# Altium schematic sheet 背景抑制经济款电子元器件示意图 - 20251224.SchDoc
size A2
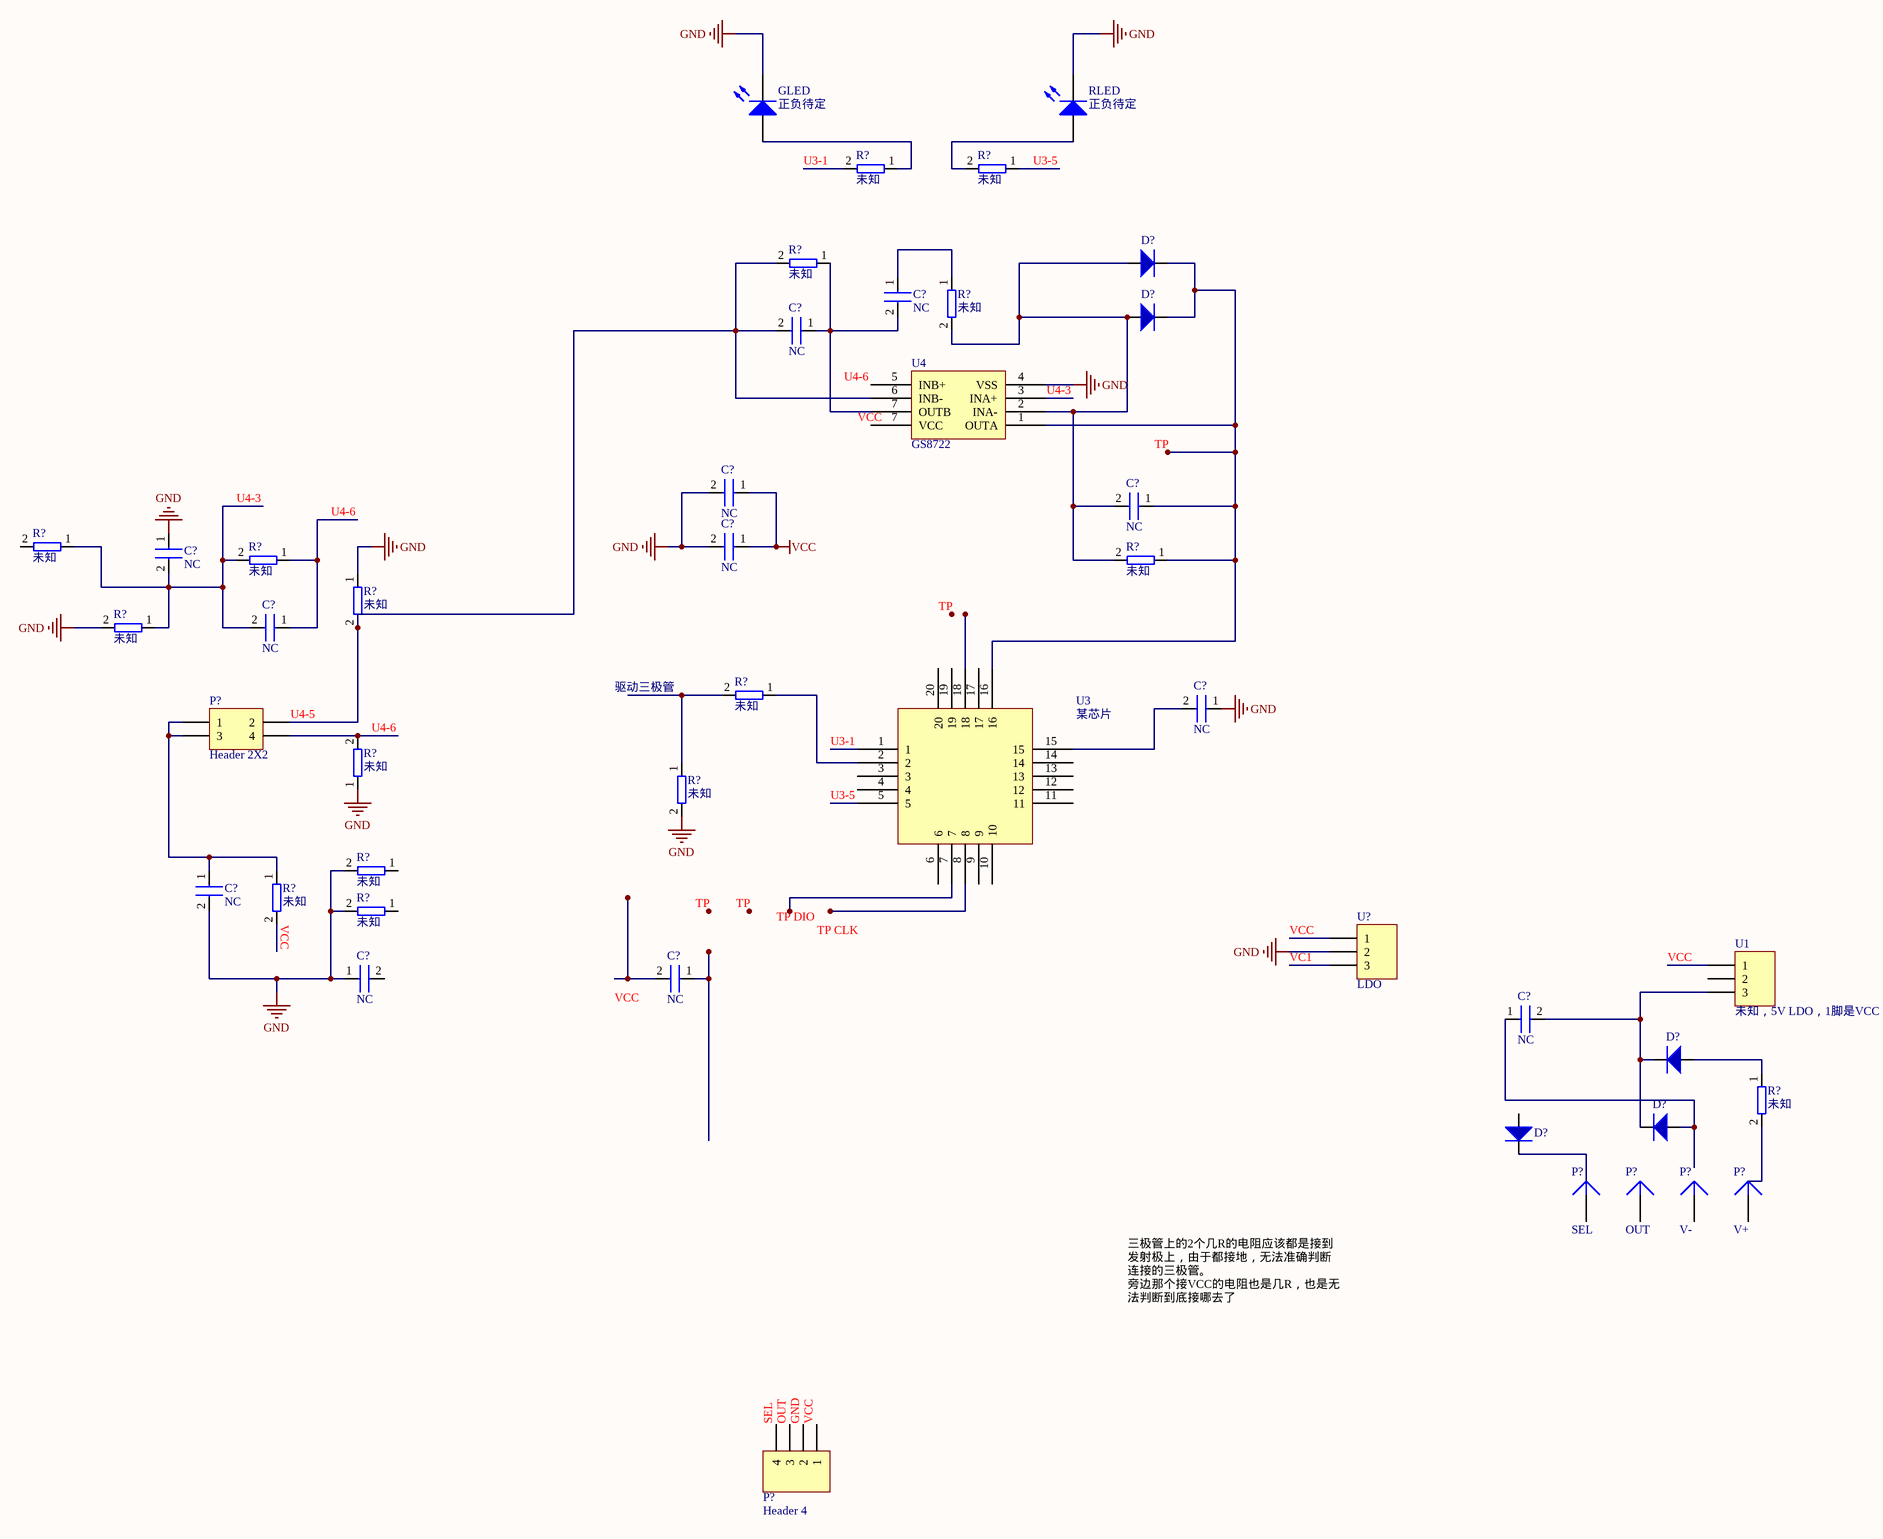
[diagram p0: 背景抑制经济款电子元器件示意图 - 20251224.SchDoc]

## Parts
(Parts that share a designator on the sheet are numbered #1, #2 ... from top to bottom, then left to right.)
C?#1  NC
C?#2  NC
C?#3  NC
C?#4  NC
C?#5  NC
C?#6  NC
C?#7  NC
C?#8  NC
C?#9  NC
C?#10  NC
C?#11  NC
C?#12  NC
D?#1  (no value)
D?#2  (no value)
D?#3  (no value)
D?#4  (no value)
D?#5  (no value)
GLED  正负待定  [LED-0]
P?#1  Header 2X2  [HDR2X2]
P?#2  SEL  [PIN1]
P?#3  OUT  [PIN1]
P?#4  V-  [PIN1]
P?#5  V+  [PIN1]
P?#6  Header 4  [HDR1X4]
R?#1  未知
R?#2  未知
R?#3  未知
R?#4  未知
R?#5  未知
R?#6  未知
R?#7  未知
R?#8  未知
R?#9  未知
R?#10  未知
R?#11  未知
R?#12  未知
R?#13  未知
R?#14  未知
R?#15  未知
R?#16  未知
RLED  正负待定  [LED-0]
U1  未知，5V LDO，1脚是VCC 5V  [HDR1X3]
U3  某芯片
U4  GS8722
U?  LDO  [HDR1X3]

## Nets
GND: C?#3.2 C?#5.1 C?#6.2 C?#8.1 C?#9.2 C?#10.1 GLED.2(K) R?#8.1 R?#9.2 R?#11.2 R?#12.1 R?#14.2 R?#15.2 RLED.2(K) U4.4(VSS) U?.2
VCC: C?#3.1 C?#6.1
NetC?#1_1: C?#1.1 R?#4.1
NetC?#1_2: C?#1.2 C?#2.1 R?#3.1 U4.7(OUTB)
NetC?#2_2: C?#2.2 P?#1.2 R?#3.2 R?#8.2 U4.6(INB-)
NetC?#4_1: C?#4.1 D?#1.2 D?#2.2 R?#7.1 U3.16 U4.1(OUTA)
NetC?#4_2: C?#4.2 D?#1.1 D?#2.1 R?#4.2 R?#7.2 U4.2(INA-)
NetC?#5_2: C?#5.2 C?#7.2 R?#5.1 R?#6.2 R?#9.1
NetC?#7_1: C?#7.1 R?#6.1
NetC?#8_2: C?#8.2 U3.15
NetC?#9_1: C?#9.1 P?#1.1 P?#1.3 R?#13.1
NetC?#12_1: C?#12.1 D?#4.1
NetC?#12_2: C?#12.2 D?#3.2 D?#4.2 U1.3
NetD?#3_1: D?#3.1 R?#16.1
NetGLED_1: GLED.1(A) R?#1.1
NetP?#1_4: P?#1.4 R?#12.2
NetR?#2_2: R?#2.2 RLED.1(A)
NetR?#10_1: R?#10.1 U3.2
NetR?#10_2: R?#10.2 R?#11.1

Not connected (* = marked no-connect by the designer): C?#10 2; C?#11 1 2; D?#5 1 2; P?#2 1; P?#3 1; P?#4 1; P?#5 1; P?#6 1 2 3 4; R?#1 2; R?#2 1; R?#5 2; R?#13 2; R?#14 1; R?#15 1; R?#16 2; U1 1 2; U3 1 3 4 5 6 7 8 9 10 11 12 13 14 17 18 19 20; U4 3(INA+) 5(INB+); U? 1 3

## Notes on the sheet
- (near R?#1) U3-1
- U3-5
- U4-6
- (near U4) VCC
- (near U4) U4-3
- TP
- U4-3
- 驱动三极管
- (near P?#1) U4-5
- (near R?#12) U4-6
- (near U3) U3-1
- (near U3) U3-5
- (near R?#13) VCC
- TP DIO
- TP CLK
- (near U?) VCC
- (near U?) VC1
- (near U1) VCC
- (near C?#11) VCC
- 三极管上的2个几R的电阻应该都是接到发射极上，由于都接地，无法准确判断连接的三极管。
  旁边那个接VCC的电阻也是几R，也是无法判断到底接哪去了
- (near P?#6) SEL
- (near P?#6) OUT
- (near P?#6) GND
- (near P?#6) VCC

## Library data of the parts
C?#1-C?#12 = CAP
D?#1-D?#5 = D
GLED RLED = LED0: Typical INFRARED GaAs LED; Published: 8-Jun-2000; LatestRevisionDate: 08-Jul-2005; LatestRevisionNote: Mech Layer 1 removed.; PackageReference: LED-0; Publisher: Altium Limited; PackageDescription: LED; 2 Leads
P?#1 = Header 2X2: Header, 2-Pin, Dual row; LatestRevisionDate: 17-Jul-2002; LatestRevisionNote: Re-released for DXP Platform.; Publisher: Altium Limited
P?#2-P?#5 = Plug: LatestRevisionDate: 17-Jul-2002; LatestRevisionNote: Re-released for DXP Platform.; Publisher: Altium Limited
P?#6 = Header 4: Header, 4-Pin; LatestRevisionDate: 17-Jul-2002; LatestRevisionNote: Re-released for DXP Platform.; Publisher: Altium Limited
R?#1-R?#16 = RES
U1 U? = Header 3: Header, 3-Pin; LatestRevisionDate: 17-Jul-2002; LatestRevisionNote: Re-released for DXP Platform.; Publisher: Altium Limited
U4 = GS358